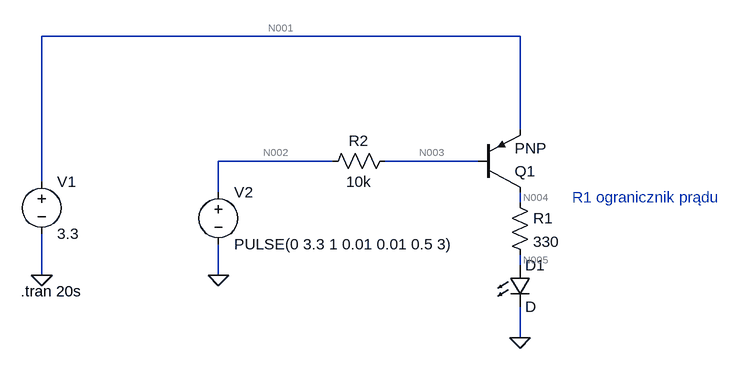
[diagram p0: schematic schemat2.asc]
schemat2.asc, the LTspice schematic file:
Version 4
SHEET 1 880 680
WIRE -192 -240 -928 -240
WIRE -192 -96 -192 -240
WIRE -480 -48 -656 -48
WIRE -256 -48 -400 -48
WIRE -928 -16 -928 -240
WIRE -656 0 -656 -48
WIRE -192 16 -192 0
WIRE -192 112 -192 96
WIRE -928 128 -928 64
WIRE -656 128 -656 80
WIRE -192 224 -192 176
FLAG -928 128 0
FLAG -192 224 0
FLAG -656 128 0
SYMBOL voltage -928 -32 R0
WINDOW 123 0 0 Left 0
WINDOW 39 0 0 Left 0
SYMATTR InstName V1
SYMATTR Value 3.3
SYMBOL voltage -656 -16 R0
WINDOW 123 0 0 Left 0
WINDOW 39 0 0 Left 0
SYMATTR InstName V2
SYMATTR Value PULSE(0 3.3 1 0.01 0.01 0.5 3)
SYMBOL res -208 0 R0
SYMATTR InstName R1
SYMATTR Value 330
SYMBOL pnp -256 0 M180
SYMATTR InstName Q1
SYMBOL res -384 -64 R90
WINDOW 0 0 56 VBottom 2
WINDOW 3 32 56 VTop 2
SYMATTR InstName R2
SYMATTR Value 10k
SYMBOL LED -208 112 R0
SYMATTR InstName D1
TEXT -960 152 Left 2 !.tran 20s
TEXT -112 8 Left 2 ;R1 ogranicznik prądu

The netlist it stands for:
* schemat2.asc
V1 N001 0 3.3
V2 N002 0 PULSE(0 3.3 1 0.01 0.01 0.5 3)
R1 N004 N005 330
Q1 N004 N003 N001 0 PNP
R2 N003 N002 10k
D1 N005 0 D
.model D D
.lib standard.dio
.model NPN NPN
.model PNP PNP
.lib standard.bjt
.tran 20s
* R1 ogranicznik prądu
.backanno
.end

* Results of the author's LTspice run, read from the files saved beside the schematic
* Operating Point, zero values left out:
*   V(n001) = 3.3 V
*   V(n004) = 3.2 V
*   V(n005) = 707.4 mV
*   V(n003) = 2.472 V
*   Ic(Q1) = -7.555 mA
*   Ib(Q1) = -247.2 µA
*   Ie(Q1) = 7.802 mA
*   I(D1) = 7.555 mA
*   I(R1) = 7.555 mA
*   I(R2) = 247.2 µA
*   I(V1) = -7.802 mA
*   I(V2) = 247.2 µA
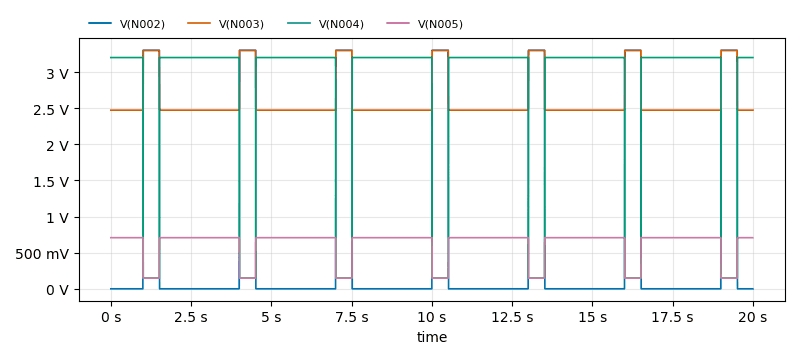
[diagram p1: Transient Analysis of schemat2.asc, plotted from the saved traces]
* Transient Analysis, 1 run:
*   V(N002): min 0 V, max 3.3 V, average 589 mV, rms 1.39 V, last 0 V
*   V(N003): min 2.472 V, max 3.3 V, average 2.618 V, rms 2.637 V, last 2.472 V
*   V(N004): min 147 mV, max 3.201 V, average 2.658 V, rms 2.902 V, last 3.2 V
*   V(N005): min 147 mV, max 707.4 mV, average 608.7 mV, rms 644.9 mV, last 707.4 mV